# Altium schematic sheet dv_spectrum_col.SchDoc
size A4
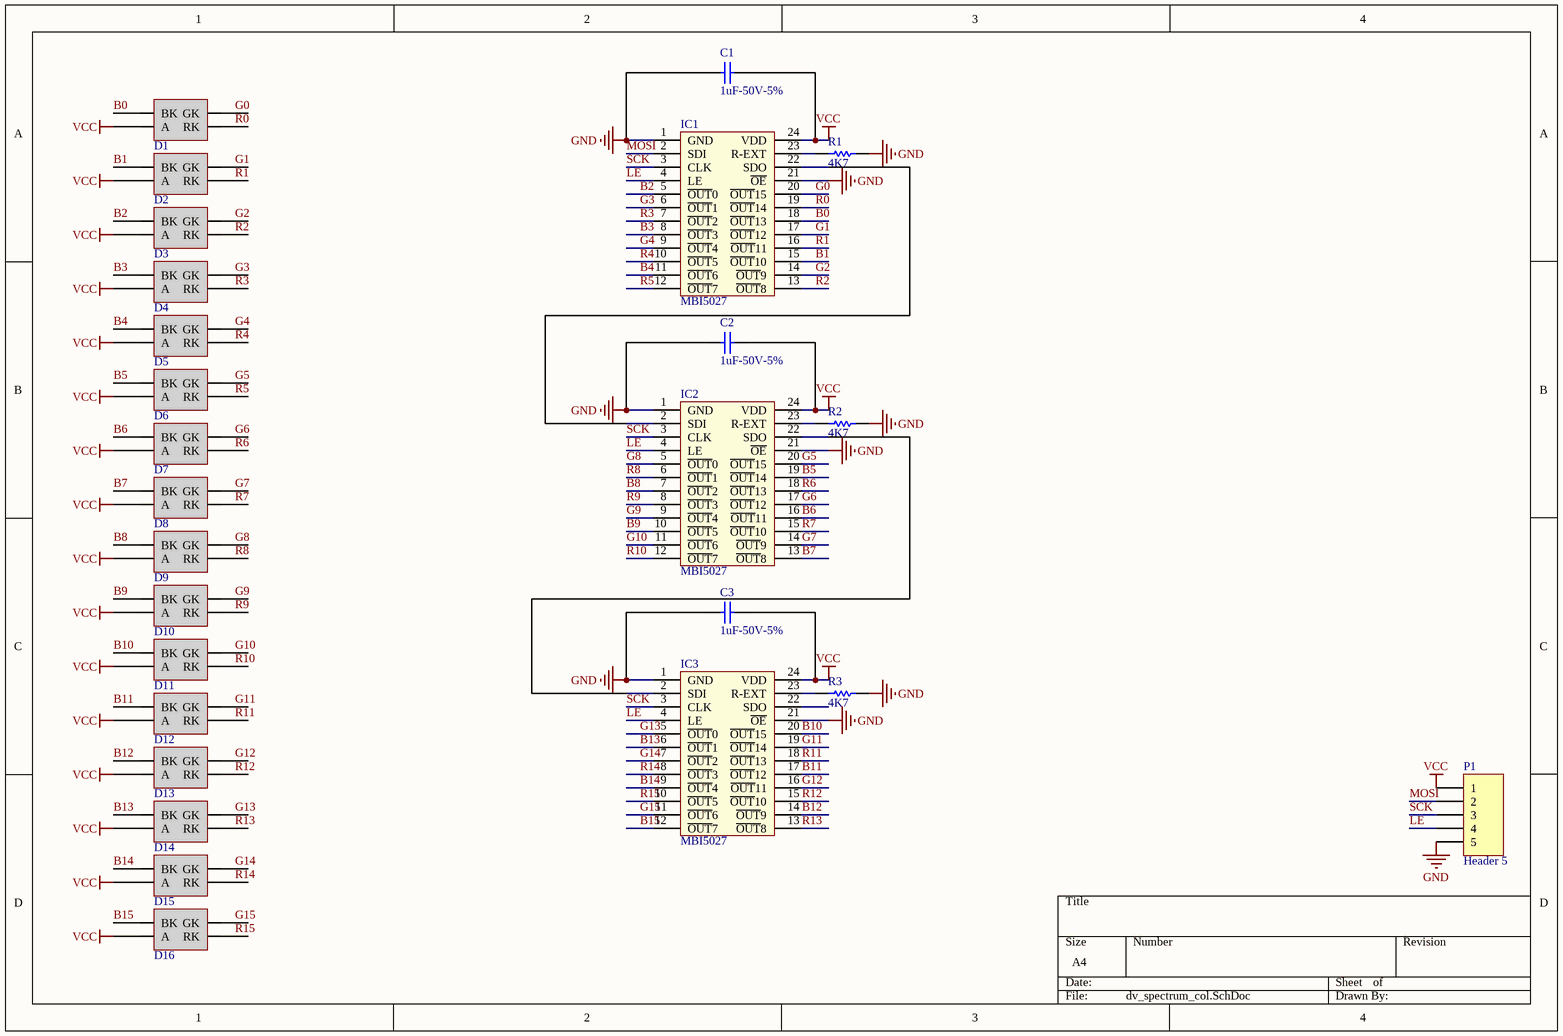
[diagram p0: dv_spectrum_col.SchDoc]

## Parts
C1  1uF-50V-5%  [CAPC2012X135N]
C2  1uF-50V-5%  [CAPC2012X135N]
C3  1uF-50V-5%  [CAPC2012X135N]
D1  LED_RGB  [LED3528(1210)-RGB]  (value not drawn)
D2  LED_RGB  [LED3528(1210)-RGB]  (value not drawn)
D3  LED_RGB  [LED3528(1210)-RGB]  (value not drawn)
D4  LED_RGB  [LED3528(1210)-RGB]  (value not drawn)
D5  LED_RGB  [LED3528(1210)-RGB]  (value not drawn)
D6  LED_RGB  [LED3528(1210)-RGB]  (value not drawn)
D7  LED_RGB  [LED3528(1210)-RGB]  (value not drawn)
D8  LED_RGB  [LED3528(1210)-RGB]  (value not drawn)
D9  LED_RGB  [LED3528(1210)-RGB]  (value not drawn)
D10  LED_RGB  [LED3528(1210)-RGB]  (value not drawn)
D11  LED_RGB  [LED3528(1210)-RGB]  (value not drawn)
D12  LED_RGB  [LED3528(1210)-RGB]  (value not drawn)
D13  LED_RGB  [LED3528(1210)-RGB]  (value not drawn)
D14  LED_RGB  [LED3528(1210)-RGB]  (value not drawn)
D15  LED_RGB  [LED3528(1210)-RGB]  (value not drawn)
D16  LED_RGB  [LED3528(1210)-RGB]  (value not drawn)
IC1  MBI5027  [SSOP24]
IC2  MBI5027  [SSOP24]
IC3  MBI5027  [SSOP24]
P1  Header 5  [HDR1X5]
R1  value 4K7  [R0805]  (hidden comment: Res1)
R2  value 4K7  [R0805]  (hidden comment: Res1)
R3  value 4K7  [R0805]  (hidden comment: Res1)

## Nets
GND: C1.1 C2.1 C3.1 IC1.1(GND) IC1.21(~{OE}) IC2.1(GND) IC2.21(~{OE}) IC3.1(GND) IC3.21(~{OE}) P1.5 R1.2 R2.2 R3.2
VCC: C1.2 C2.2 C3.2 D1.2(A) D2.2(A) D3.2(A) D4.2(A) D5.2(A) D6.2(A) D7.2(A) D8.2(A) D9.2(A) D10.2(A) D11.2(A) D12.2(A) D13.2(A) D14.2(A) D15.2(A) D16.2(A) IC1.24(VDD) IC2.24(VDD) IC3.24(VDD) P1.1
B0: D1.3(BK) IC1.18(~{OUT}13)
B1: D2.3(BK) IC1.15(~{OUT}10)
B2: D3.3(BK) IC1.5(~{OUT}0)
B3: D4.3(BK) IC1.8(~{OUT}3)
B4: D5.3(BK) IC1.11(~{OUT}6)
B5: D6.3(BK) IC2.19(~{OUT}14)
B6: D7.3(BK) IC2.16(~{OUT}11)
B7: D8.3(BK) IC2.13(~{OUT}8)
B8: D9.3(BK) IC2.7(~{OUT}2)
B9: D10.3(BK) IC2.10(~{OUT}5)
B10: D11.3(BK) IC3.20(~{OUT}15)
B11: D12.3(BK) IC3.17(~{OUT}12)
B12: D13.3(BK) IC3.14(~{OUT}9)
B13: D14.3(BK) IC3.6(~{OUT}1)
B14: D15.3(BK) IC3.9(~{OUT}4)
B15: D16.3(BK) IC3.12(~{OUT}7)
G0: D1.4(GK) IC1.20(~{OUT}15)
G1: D2.4(GK) IC1.17(~{OUT}12)
G2: D3.4(GK) IC1.14(~{OUT}9)
G3: D4.4(GK) IC1.6(~{OUT}1)
G4: D5.4(GK) IC1.9(~{OUT}4)
G5: D6.4(GK) IC2.20(~{OUT}15)
G6: D7.4(GK) IC2.17(~{OUT}12)
G7: D8.4(GK) IC2.14(~{OUT}9)
G8: D9.4(GK) IC2.5(~{OUT}0)
G9: D10.4(GK) IC2.9(~{OUT}4)
G10: D11.4(GK) IC2.11(~{OUT}6)
G11: D12.4(GK) IC3.19(~{OUT}14)
G12: D13.4(GK) IC3.16(~{OUT}11)
G13: D14.4(GK) IC3.5(~{OUT}0)
G14: D15.4(GK) IC3.7(~{OUT}2)
G15: D16.4(GK) IC3.11(~{OUT}6)
LE: IC1.4(LE) IC2.4(LE) IC3.4(LE) P1.4
MOSI: IC1.2(SDI) P1.2
R0: D1.1(RK) IC1.19(~{OUT}14)
R1: D2.1(RK) IC1.16(~{OUT}11)
R2: D3.1(RK) IC1.13(~{OUT}8)
R3: D4.1(RK) IC1.7(~{OUT}2)
R4: D5.1(RK) IC1.10(~{OUT}5)
R5: D6.1(RK) IC1.12(~{OUT}7)
R6: D7.1(RK) IC2.18(~{OUT}13)
R7: D8.1(RK) IC2.15(~{OUT}10)
R8: D9.1(RK) IC2.6(~{OUT}1)
R9: D10.1(RK) IC2.8(~{OUT}3)
R10: D11.1(RK) IC2.12(~{OUT}7)
R11: D12.1(RK) IC3.18(~{OUT}13)
R12: D13.1(RK) IC3.15(~{OUT}10)
R13: D14.1(RK) IC3.13(~{OUT}8)
R14: D15.1(RK) IC3.8(~{OUT}3)
R15: D16.1(RK) IC3.10(~{OUT}5)
SCK: IC1.3(CLK) IC2.3(CLK) IC3.3(CLK) P1.3
NetIC1_22: IC1.22(SDO) IC2.2(SDI)
NetIC1_23: IC1.23(R-EXT) R1.1
NetIC2_22: IC2.22(SDO) IC3.2(SDI)
NetIC2_23: IC2.23(R-EXT) R2.1
NetIC3_23: IC3.23(R-EXT) R3.1

Not connected (* = marked no-connect by the designer): IC3 22(SDO)

## Library data of the parts
C1-C3 = Cap: CAP CER 15PF 50V 5% NPO 0603; Manufacturer: Yageo; Manufacturer Part Number: CC0603JRNPO9BN150; Published: 8-Jun-2000; LatestRevisionDate: 17-Jul-2002; LatestRevisionNote: Re-released for DXP Platform.; PackageReference: C0603; Publisher: Altium Limited; Value: 1uF-50V-5%; Digi-Key Part Number: 311-1060-1-ND; Unit Price: 0.01338
D1-D16 = LED_RGB_1210
IC1-IC3 = MBI5027: 16 bit Constant Current LED; Creat by: VanDungEvn@Gmail.com; Compoment same: SM16126
P1 = Header 5: Header, 5-Pin; LatestRevisionDate: 17-Jul-2002; LatestRevisionNote: Re-released for DXP Platform.; Publisher: Altium Limited
R1-R3 = Res1: Resistor; Published: 8-Jun-2000; LatestRevisionDate: 17-Jul-2002; LatestRevisionNote: Re-released for DXP Platform.; PackageReference: AXIAL-0.3; Publisher: Altium Limited